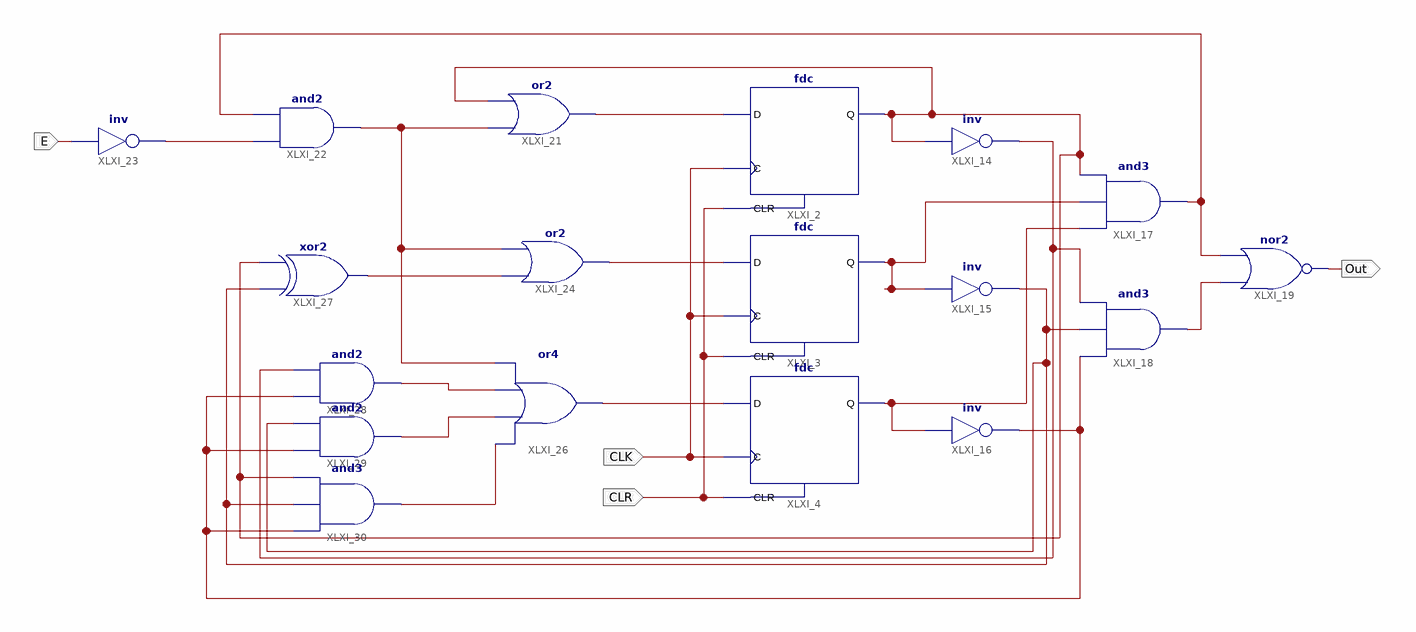
[diagram p0: schematic sheet 1]
// Xilinx ISE schematic C4_21.sch (kintex7) as structural Verilog: 18 symbols, 4 ports
module C4_21 (
  input  CLK,
  input  CLR,
  input  E,
  output Out
);

  wire XLXN_10, XLXN_12, XLXN_13, XLXN_18, XLXN_19, XLXN_22, XLXN_23, XLXN_25, XLXN_26, XLXN_27, XLXN_29,
       XLXN_30, XLXN_31, XLXN_32, XLXN_33, XLXN_38, XLXN_40;

  fdc XLXI_2 (.C(CLK), .CLR(CLR), .D(XLXN_19), .Q(XLXN_30));
  fdc XLXI_3 (.C(CLK), .CLR(CLR), .D(XLXN_25), .Q(XLXN_12));
  fdc XLXI_4 (.C(CLK), .CLR(CLR), .D(XLXN_26), .Q(XLXN_10));
  not XLXI_14 (XLXN_13, XLXN_30);
  not XLXI_15 (XLXN_40, XLXN_12);
  not XLXI_16 (XLXN_38, XLXN_10);
  and XLXI_17 (XLXN_22, XLXN_10, XLXN_12, XLXN_30);
  and XLXI_18 (XLXN_18, XLXN_38, XLXN_40, XLXN_13);
  nor XLXI_19 (Out, XLXN_18, XLXN_22);
  or XLXI_21 (XLXN_19, XLXN_27, XLXN_30);
  and XLXI_22 (XLXN_27, XLXN_23, XLXN_22);
  not XLXI_23 (XLXN_23, E);
  or XLXI_24 (XLXN_25, XLXN_29, XLXN_27);
  or XLXI_26 (XLXN_26, XLXN_33, XLXN_32, XLXN_31, XLXN_27);
  xor XLXI_27 (XLXN_29, XLXN_40, XLXN_30);
  and XLXI_28 (XLXN_31, XLXN_38, XLXN_13);
  and XLXI_29 (XLXN_32, XLXN_38, XLXN_40);
  and XLXI_30 (XLXN_33, XLXN_38, XLXN_40, XLXN_30);
endmodule
